# Altium schematic sheet DK-PM-FV-VC-Buck_NonIsolated_V1.0.SchDoc: DK-PM-FV-VC-Buck_NonIsolated
size A4; Date: 13-Nov-2018; CompanyName: Walton Hi-Tech Ind. Ltd.; DrawnBy: Raihan Bin Mofidul; Revision: V1.0
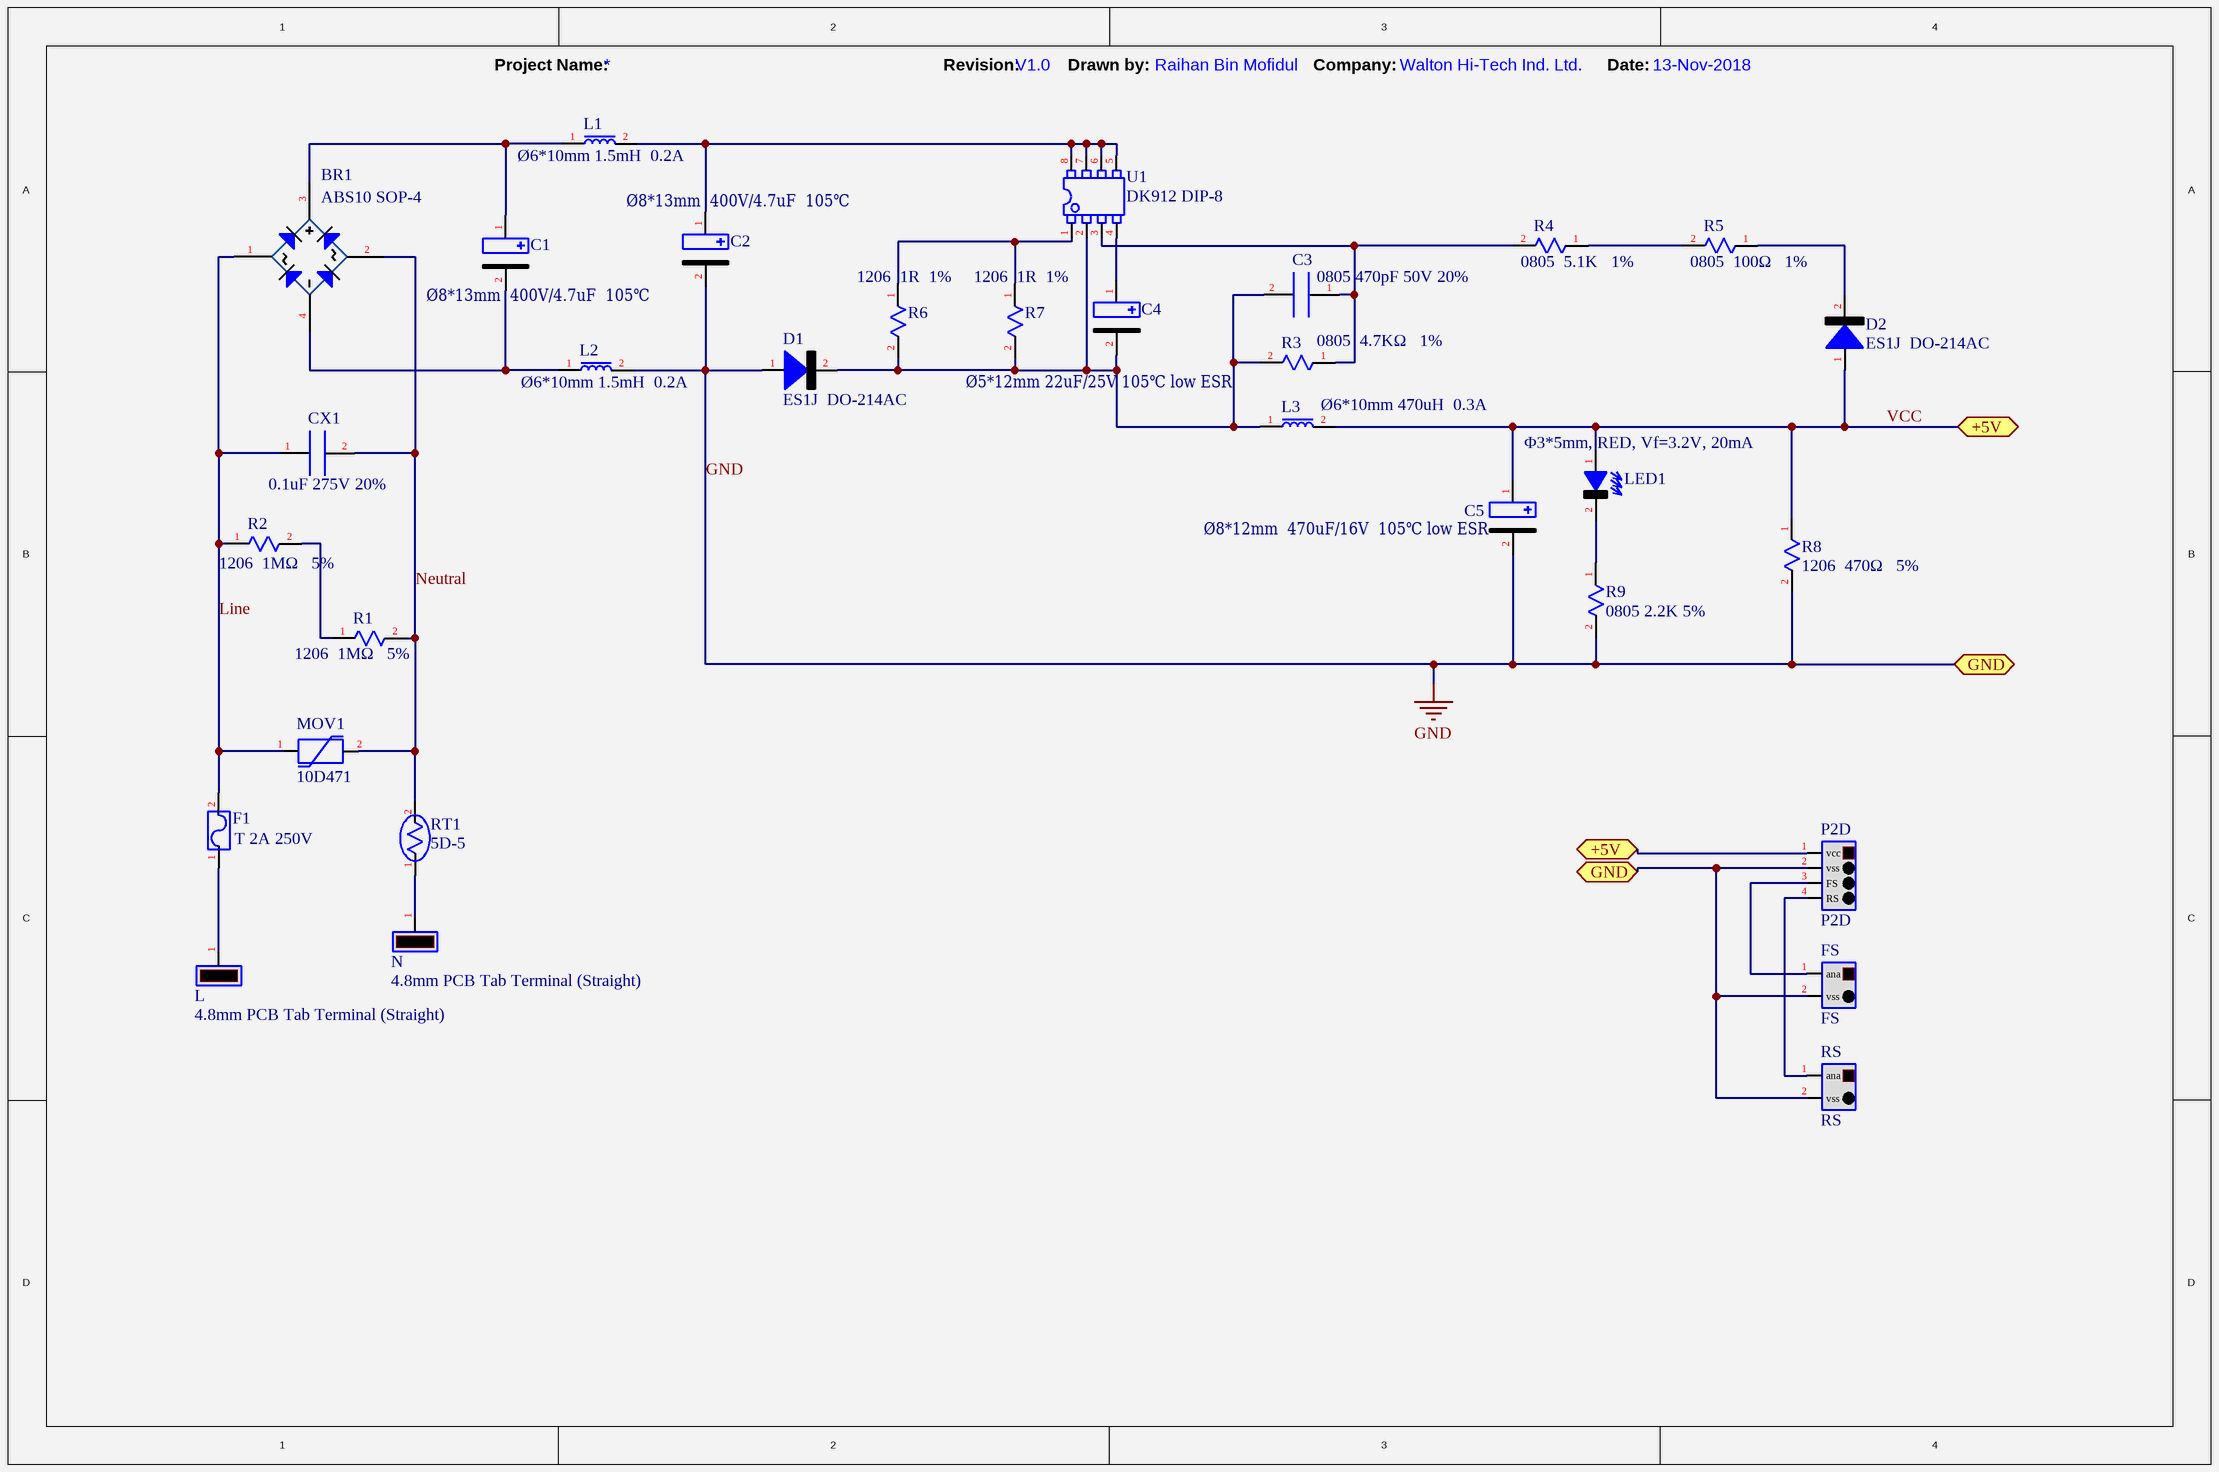
[diagram p0: DK-PM-FV-VC-Buck_NonIsolated_V1.0.SchDoc]

## Parts
BR1  ABS10 SOP-4  [BR_SMD_ABS10]
C1  Ø8*13mm  400V/4.7uF  105℃  [C_8x13_P3.556]
C2  Ø8*13mm  400V/4.7uF  105℃  [C_8x13_P3.556]
C3  0805 470pF 50V 20%  [C_0805]
C4  Ø5*12mm 22uF/25V 105℃ low ESR  [C_5x12_P2.54]
C5  Ø8*12mm  470uF/16V  105℃ low ESR  [C_8x12_P3.556]
CX1  0.1uF 275V 20%  [C_X1_P10]
D1  ES1J  DO-214AC  [D_ES1J-DO-214AC]
D2  ES1J  DO-214AC  [D_ES1J-DO-214AC]
F1  T 2A 250V  [F_4x8_P5]
FS  FS  [CN_B2B-XH-A_RED]
L  4.8mm PCB Tab Terminal (Straight)  [CN_4.8mm PCB Tab Terminal (Straight)]
L1  Ø6*10mm 1.5mH  0.2A  [L_6x10_P3]
L2  Ø6*10mm 1.5mH  0.2A  [L_6x10_P3]
L3  Ø6*10mm 470uH  0.3A  [L_6x10_P3]
LED1  Φ3*5mm, RED, Vf=3.2V, 20mA  [LED_3x5_P2.5]
MOV1  10D471  [MOV_10D471]
N  4.8mm PCB Tab Terminal (Straight)  [CN_4.8mm PCB Tab Terminal (Straight)]
P2D  P2D  [CN_BM04B-GHS-TBT_180_DIP]
R1  1206  1MΩ   5%  [R_1206]
R2  1206  1MΩ   5%  [R_1206]
R3  0805  4.7KΩ   1%  [R_0805]
R4  0805  5.1K   1%  [R_0805]
R5  0805  100Ω   1%  [R_0805]
R6  1206  1R  1%  [R_1206]
R7  1206  1R  1%  [R_1206]
R8  1206  470Ω   5%  [R_1206]
R9  0805 2.2K 5%  [R_0805]
RS  RS  [CN_B2B-XH-A_WHITE]
RT1  5D-5  [RT_5D-5-(B)]
U1  DK912 DIP-8  [U_DK912_TH]

## Ports
+5V (bidir), GND (bidir)

## Nets
GND: C2.2(vss) C5.2(vss) D1.1(vdd) FS.2(vss) L2.2 P2D.2(vss) R8.2 R9.2 RS.2(vss) ; port GND
Line: BR1.1(AC) CX1.1 F1.2 MOV1.1 R2.1
Neutral: BR1.2(AC) CX1.2 MOV1.2 R1.2 RT1.2
VCC: C5.1(vdd) D2.1(vdd) L3.2 LED1.1(vdd) P2D.1(vcc) R8.1 ; port +5V
NetBR1_3: BR1.3(VCC) C1.1(vdd) L1.1
NetBR1_4: BR1.4(VSS) C1.2(vss) L2.1
NetC2_1: C2.1(vdd) L1.2 U1.5 U1.6 U1.7 U1.8
NetC3_1: C3.1 R3.1 R4.2 U1.3
NetC3_2: C3.2 C4.2(vss) D1.2(vss) L3.1 R3.2 R6.2 R7.2 U1.2
NetC4_1: C4.1(vdd) U1.4
NetD2_2: D2.2(vss) R5.1
NetF1_1: F1.1 L.1
NetFS_1: FS.1(ana) P2D.3(FS)
NetLED1_2: LED1.2(vss) R9.1
NetN_1: N.1 RT1.1
NetP2D_4: P2D.4(RS) RS.1(ana)
NetR1_1: R1.1 R2.2
NetR4_1: R4.1 R5.2
NetR6_1: R6.1 R7.1 U1.1

## Notes on the sheet
- (near L1) Project Name:
- Revision:
- Drawn by:
- Company:
- Date:

## Library data of the parts
BR1 = Bridge Rectifier: pin to pad: 1>2 2>1
C1 C2 C4 C5 = Capacitor Polar
C3 CX1 = Capacitor Non-Polar
D1 D2 = Diode
F1 = Fuse
FS RS = Connector_2PINs
L N = Connector_1PIN
L1-L3 = Inductor
LED1 = LED
MOV1 = Varistor
P2D = Connector_4PINs
R1-R9 = Resistor
RT1 = Thermistor
U1 = IC_SMPS_8pin